# Altium schematic sheet Power Supply.SchDoc
size A3; Company Name: Renesas Electronics America; CompanyURL: www.renesas.com; PageSetup: Record=PageOptions|CenterHorizontal=True|CenterVertical=True|PrintScale=1.00|XCorrection=1.00|YCorrection=1.00|PrintKind=1|BorderSize=5000000|LeftOffset=0|BottomOffset=0|Orientation=2|PaperLength=1000|PaperWidth=1000|Scale=100|PaperSource=7|PrintQuality=-4|MediaType=1|DitherType=10|PaperKind=A5 148x210mm|PrintScaleMode=1; ReleaseDate: 16.09.2025; Version: MP; SheetNumber: 2; SheetTotal: 18; VariantNumber: 0; DSheetNumber: 1
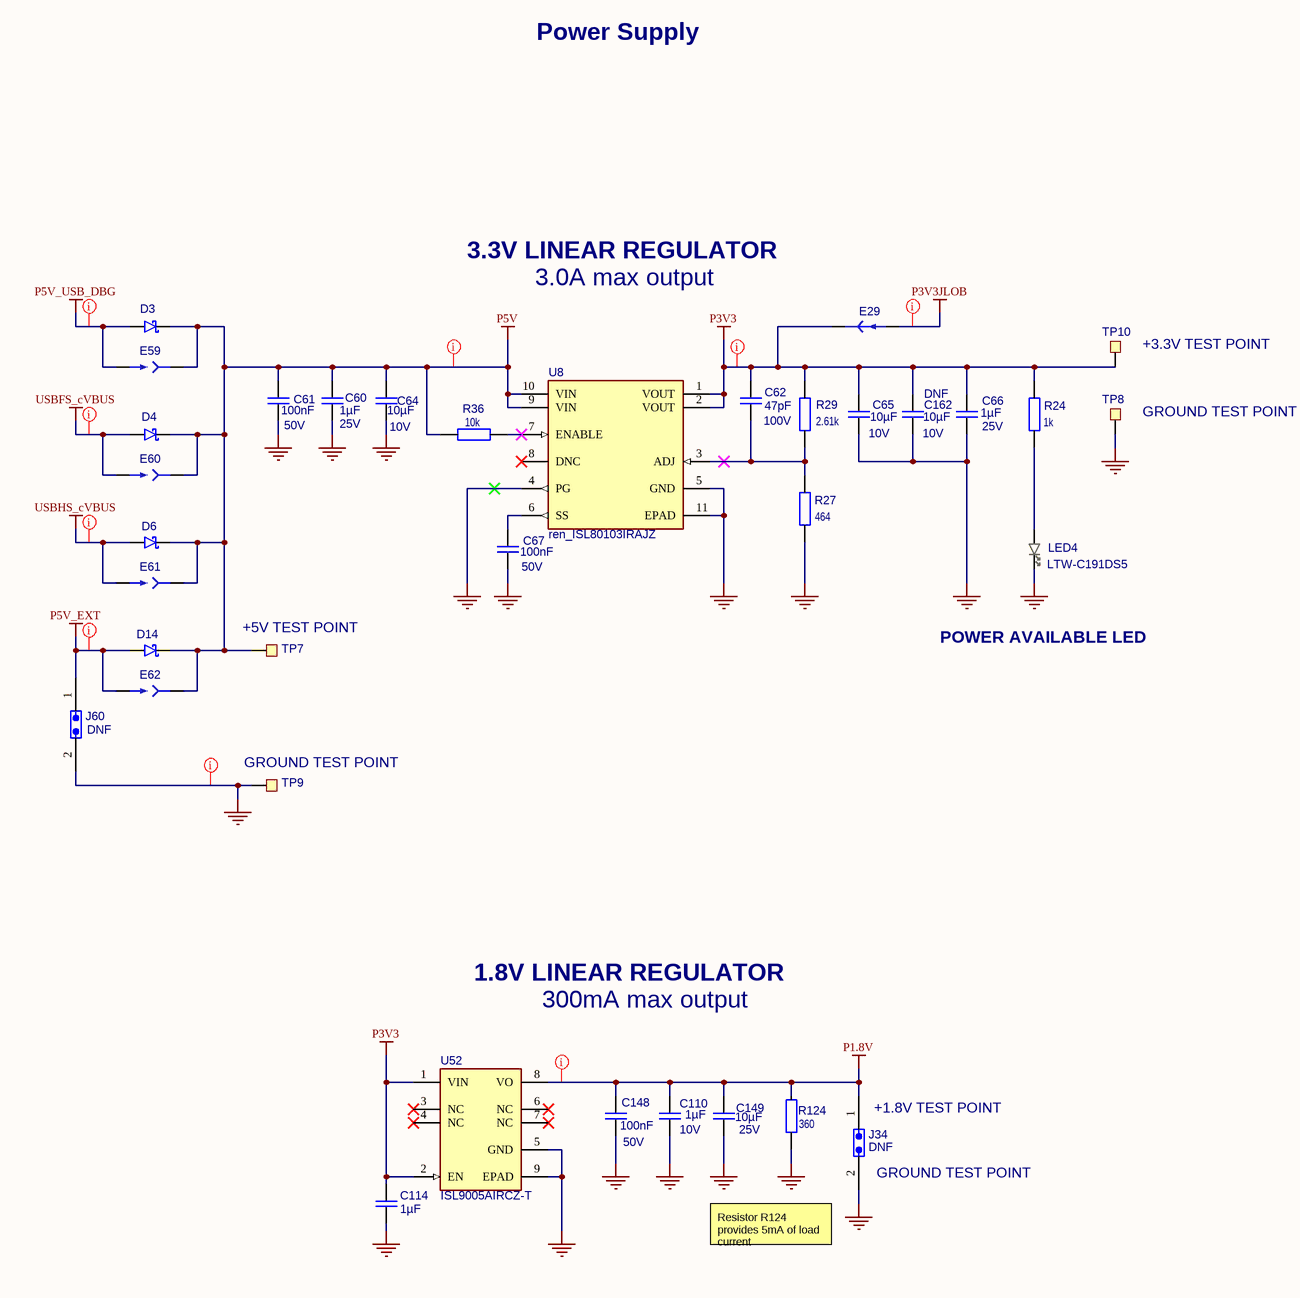
[diagram p0: Power Supply.SchDoc]

## Parts
C60  value 1µF  Operating Voltage Max: 25V  [C_EIA0402_0p6]  (hidden comment: Capacitor)
C61  value 100nF  Operating Voltage Max: 50V  [C_EIA0402_0p55]  (hidden comment: Capacitor)
C62  value 47pF  Operating Voltage Max: 100V  [C_EIA0402_0p55]  (hidden comment: Capacitor)
C64  value 10µF  Operating Voltage Max: 10V  [C_EIA0402_0p7]  (hidden comment: Capacitor)
C65  value 10µF  Operating Voltage Max: 10V  [C_EIA0402_0p7]  (hidden comment: Capacitor)
C66  value 1µF  Operating Voltage Max: 25V  [C_EIA0402_0p6]  (hidden comment: Capacitor)
C67  value 100nF  Operating Voltage Max: 50V  [C_EIA0402_0p55]  (hidden comment: Capacitor)
C110  value 1µF  Operating Voltage Max: 25V  [C_EIA0402_0p6]  (hidden comment: Capacitor)
C114  value 1µF  [C_EIA0402_0p6]  (hidden comment: Capacitor)
C148  value 100nF  Operating Voltage Max: 50V  [C_EIA0402_0p55]  (hidden comment: Capacitor)
C149  value 10µF  Operating Voltage Max: 10V  [C_EIA0402_0p7]  (hidden comment: Capacitor)
C162  value 10µF  Operating Voltage Max: 10V  [C_EIA0402_0p7]  (hidden comment: Capacitor)
D3  B340AQ-13-F  [dio_SMA]  (value not drawn)
D4  B340AQ-13-F  [dio_SMA]  (value not drawn)
D6  B340AQ-13-F  [dio_SMA]  (value not drawn)
D14  B340AQ-13-F  [dio_SMA]  (value not drawn)
E29  TRACE_CUT_0805  [trace_cut_0805]  (value not drawn)  (net tie, no BOM)
E59  SOLDER_BRIDGE_0805  [solder_bridge_0805]  (value not drawn)  (no BOM)
E60  SOLDER_BRIDGE_0805  [solder_bridge_0805]  (value not drawn)  (no BOM)
E61  SOLDER_BRIDGE_0805  [solder_bridge_0805]  (value not drawn)  (no BOM)
E62  SOLDER_BRIDGE_0805  [solder_bridge_0805]  (value not drawn)  (no BOM)
J34  61300211121  [wue_61300211121]  (value not drawn)
J60  61300211121  [wue_61300211121]  (value not drawn)
LED4  LTW-C191DS5  [led_0603_w]
R24  value 1k  [R_EIA0402]  (hidden comment: RC0402FR-071KL)
R27  value 464  [R_EIA0603]  (hidden comment: Resistor)
R29  value 2.61k  [R_EIA0603]  (hidden comment: Resistor)
R36  value 10k  [R_EIA0402]  (hidden comment: Resistor)
R124  value 360  [R_EIA0402]  (hidden comment: Resistor)
TP7  TP_Mini  [key_5019]  (value not drawn)
TP8  TP_Mini  [key_5019]  (value not drawn)
TP9  TP_Mini  [key_5019]  (value not drawn)
TP10  TP_Mini  [key_5019]  (value not drawn)
U8  ren_ISL80103IRAJZ  [ren_tdfn10_L10.3X3]
U52  ISL9005AIRCZ-T  [ren_DFN-8_3.00x2.00mm]

## Nets
GND: C60.2 C61.1 C64.1 C65.1 C66.2 C67.1 C110.2 C114.2 C148.1 C149.1 C162.1 J34.2 J60.2 LED4.1(K) R27.1 R124.1 TP8.1 TP9.1 U8.4(PG) U8.5(GND) U8.11(EPAD) U52.5(GND) U52.9(EPAD)
P1.8V: C110.1 C148.2 C149.2 J34.1 R124.2 U52.8(VO)
P3V3: C62.1 C65.2 C66.1 C114.1 C162.2 E29.1 R24.2 R29.2 TP10.1 U8.1(VOUT) U8.2(VOUT) U52.1(VIN) U52.2(EN)
P3V3JLOB: E29.2
P5V: C60.1 C61.2 C64.2 D3.1(K) D4.1(K) D6.1(K) D14.1(K) E59.1 E60.1 E61.1 E62.1 R36.1 TP7.1 U8.9(VIN) U8.10(VIN)
P5V_EXT: D14.2(A) E62.2 J60.1
P5V_USB_DBG: D3.2(A) E59.2
USBFS_cVBUS: D4.2(A) E60.2
USBHS_cVBUS: D6.2(A) E61.2
NetC62_2: C62.2 R27.2 R29.1 U8.3(ADJ)
NetC67_2: C67.2 U8.6(SS)
NetLED4_2: LED4.2(A) R24.1
NetR36_2: R36.2 U8.7(ENABLE)

Not connected (* = marked no-connect by the designer): U8 8(DNC)*; U52 3(NC)* 4(NC)* 6(NC)* 7(NC)*

## Layout directives
net class Power; rule Supply Nets [Voltage = 5.000]: P5V, P5V_EXT, P5V_USB_DBG, USBFS_cVBUS, USBHS_cVBUS
net class Power; rule Supply Nets [Voltage = 3.300]: P3V3, P3V3JLOB
net class Power; rule Supply Nets [Voltage = 1.800]: P1.8V
net class Power; rule Supply Nets [Voltage = 0.000]: GND

## Notes on the sheet
- Power Supply
- 3.0A max output
- 3.3V LINEAR REGULATOR
- (near TP10) +3.3V TEST POINT
- (near TP8) GROUND TEST POINT
- (near TP7) +5V TEST POINT
- POWER AVAILABLE LED
- (near TP9) GROUND TEST POINT
- 300mA max output
- 1.8V LINEAR REGULATOR
- (near J34) +1.8V TEST POINT
- (near J34) GROUND TEST POINT
- Resistor R124 provides 5mA of load current
- www.renesas.com <http://www.renesas.com>
- Sheet:
- Title:
- Document Number:
- Version:
- Variant:
- Renesas Electronics
- Size:
- A3
- Date:
- Time:
- Page:
- of
- Product Issue:

## Library data of the parts
C60 C66 C110 C114 = CAP-00000014-5: Capacitor,EIA0402,1u,25V,X6S; Tolerance: 10%; Qualification: AEC-Q200; Subtype: MLCC; Dielectric: X6S; Height: 600µm; Operating Temperature Max: 105°C; Operating Temperature Min: -55°C
  C114: Operating Voltage Max: 25V
C61 C67 C148 = CAP-00003203-9: Capacitor,EIA0402,100n,50V,X7R; Tolerance: 10%; Qualification: AEC-Q200; Subtype: MLCC; Dielectric: X7R; Height: 550µm; Operating Temperature Max: 125°C; Operating Temperature Min: -55°C
C62 = CAP-00003209-9: Capacitor,EIA0402,47p,100V,C0G; Tolerance: 5%; Qualification: AEC-Q200; Subtype: MLCC; Dielectric: C0G; Height: 550µm; Operating Temperature Max: 125°C; Operating Temperature Min: -55°C
C64 C65 C149 C162 = CAP-00003447-8: Capacitor,EIA0402,10u,10V,X5R; Tolerance: 20%; Subtype: MLCC; Dielectric: X5R; Height: 700µm; Operating Temperature Max: 85°C; Operating Temperature Min: -55°C; Qualification: -
  C162: DNF: DNF
D3 D4 D6 D14 = DIO-00000007-5: Rectifier Diode, Schottky, 1 Phase, 1 Element, 3A, 40V V(RRM), Silicon; Forward Voltage: 500mV; Power: 850mW; Qualification: AEC-Q101; Subtype: Schottky; Height: 2.4mm; Operating Temperature Min: -55°C; Reverse Voltage: 40V; Operating Temperature Max: 150°C; Current: 3A
E29 = MIS-00000000-11: Trace Cut, SMD, 0805 size; Value: TC; Pin Count: 2; Qualification: -; Subtype: Trace Cut
E59-E62 = MIS-00000002-7: Solder Bridge, SMD, 0805 size; Value: SB; Subtype: Solder Bridge; Qualification: -; Pin Count: 2
J34 J60 = CON-00003283-14: Header,2way,1row,vertical,2.54mm,THT; Gender: male; Current: 3A; DC Resistance: 20m; Operating Voltage Max: 250V; Height: 8.89mm; Operating Temperature Min: -40°C; Operating Temperature Max: 105°C; Qualification: -; Pin Count: 2; DNF: DNF
LED4 = DIO-00000002-6: Standard LEDs, SMD Ultra Bright White; Current: 5mA; Forward Voltage: 3.15V; Power: 72mW; Reverse Voltage: 5V; Subtype: LED; Height: 550µm; Operating Temperature Max: 85°C; Operating Temperature Min: -30°C; Qualification: -
R24 = RES-00000878-9: Resistor,EIA0402,1k,0.0625W; Power: 62.5mW; Tolerance: 1%; Subtype: Chip Resistor; Operating Temperature Max: 155°C; Operating Temperature Min: -55°C; Qualification: -
R27 = RES-00002182-11: Resistor,EIA0603,464,0.1W; Power: 100mW; Tolerance: 1%; Subtype: Chip Resistor; Operating Temperature Max: 155°C; Operating Temperature Min: -55°C; Qualification: -
R29 = RES-00002248-11: Resistor,EIA0603,2.61k,0.1W; Power: 100mW; Tolerance: 1%; Subtype: Chip Resistor; Operating Temperature Max: 155°C; Operating Temperature Min: -55°C; Qualification: -
R36 = RES-00000902-9: Resistor,EIA0402,10k,0.0625W; Power: 62.5mW; Tolerance: 1%; Subtype: Chip Resistor; Operating Temperature Max: 155°C; Operating Temperature Min: -55°C; Qualification: -
R124 = RES-00000867-9: Resistor,EIA0402,360,0.0625W; Power: 62.5mW; Tolerance: 1%; Subtype: Chip Resistor; Operating Temperature Max: 155°C; Operating Temperature Min: -55°C; Qualification: -
TP7-TP10 = MIS-00003478-10: Testpoint Miniature; Value: TP; Pin Count: 1; Qualification: -; Subtype: Testpoint
U8 = ICS-00000014-3: High Performance 3A Linear Regulator; Operating Voltage Max: 6V; Operating Voltage Min: 2.2V; Output Voltage Max: 5.5V; Output Voltage Min: 800mV; Subtype: Power; Current: 3A; Operating Temperature Max: 125°C; Operating Temperature Min: -40°C; Pin Count: 10; Qualification: -
U52 = ICS-00000140-2: LDO with Low ISUPPLY, High PSRR 1.8V fixed, 300mA; Subtype: Power; Operating Voltage Max: 6.5V; Operating Voltage Min: 2.3V; Current: 300mA; Operating Temperature Max: 85°C; Pin Count: 9; Qualification: -; Operating Temperature Min: -40°C; Output Voltage Max: 1.8V; Output Voltage Min: 1.8V